# Altium schematic sheet Power - 1V5.SchDoc
size A4
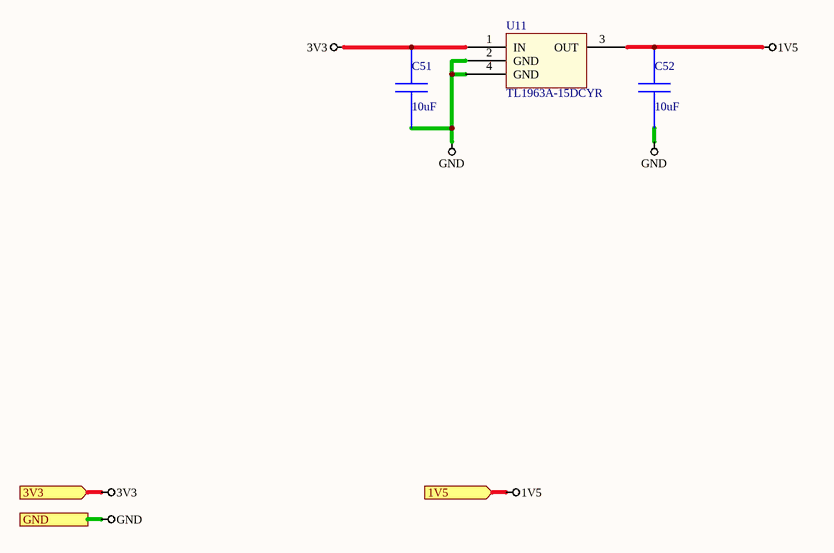
[diagram p0: Power - 1V5.SchDoc]

## Parts
C51  value 10uF  [1206]  (hidden comment: GRM31CR61E106KA12L)
C52  value 10uF  [1206]  (hidden comment: GRM31CR61E106KA12L)
U11  TL1963A-15DCYR  [DCY4]

## Ports
1V5, 3V3, GND

## Nets
1V5: C52.1 U11.3(OUT) ; port 1V5
3V3: C51.1 U11.1(IN) ; port 3V3
GND: C51.2 C52.2 U11.2(GND) U11.4(GND) ; port GND

## Library data of the parts
C51 C52 = GRM31CR61E106KA12L: GRM31CR61E106KA1; Manufacturer Name: MuRata; PackageReference: GRM31CR61E106KA12L; Manufacturer Part Number: GRM31CR61E106KA12L